# EAGLE schematic INITIAL_DESIGN (EAGLE 7.5.0)
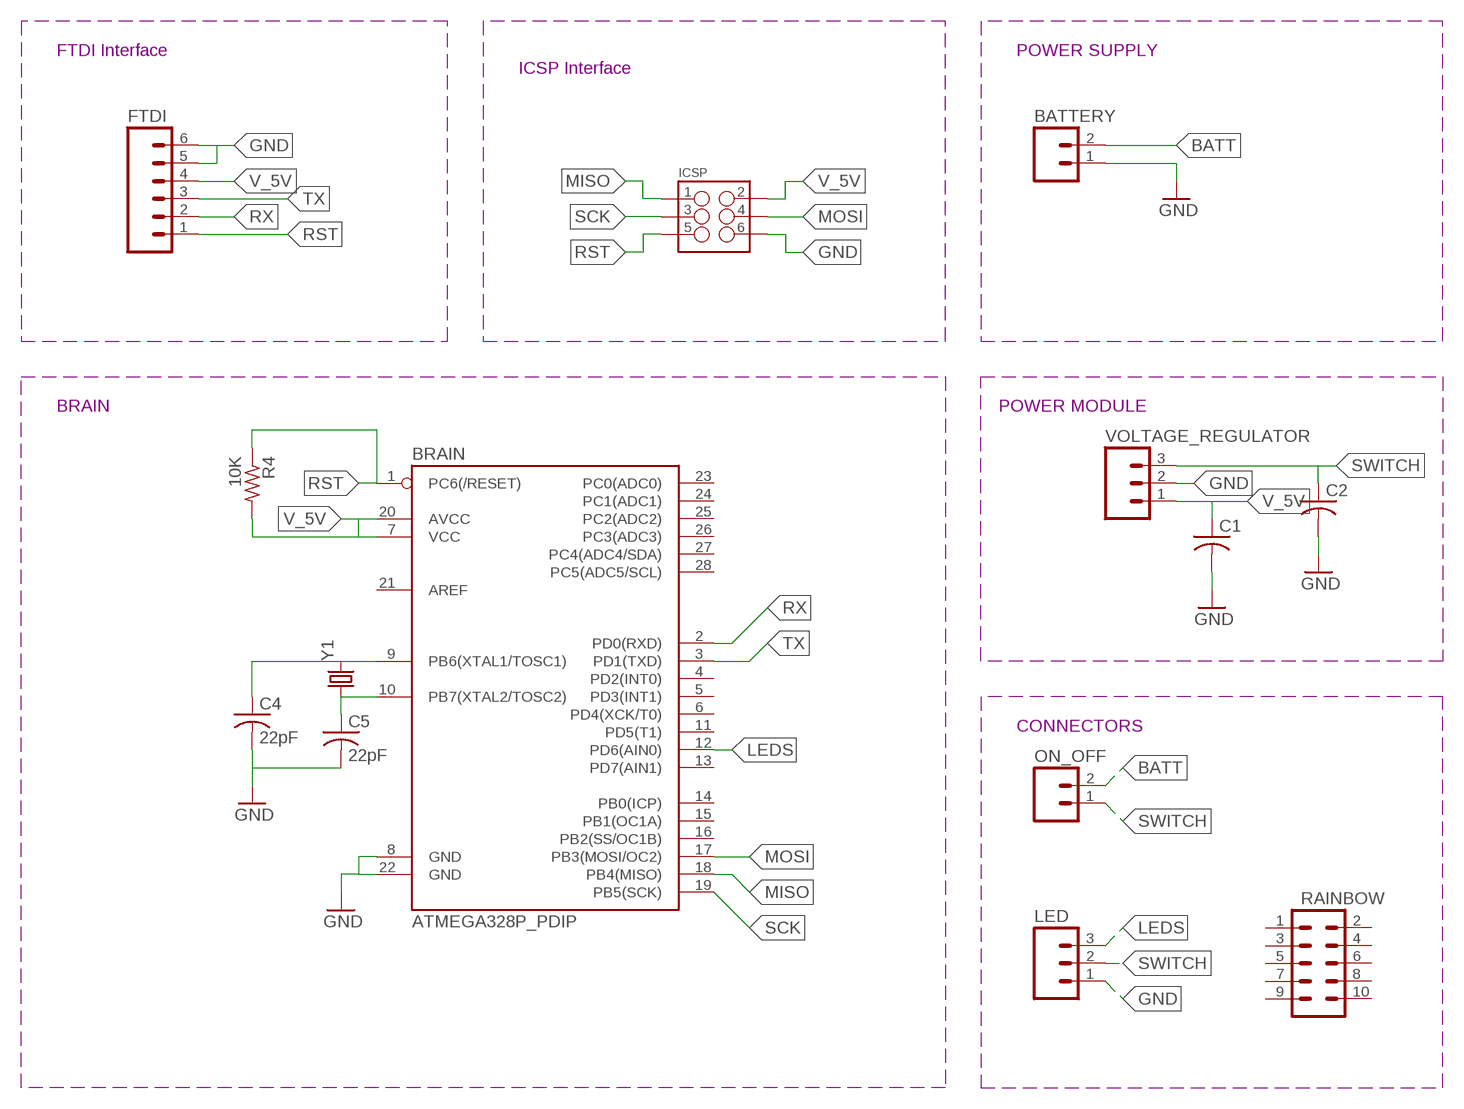
[diagram p0: schematic, sheet 1]

## Parts
BATTERY  M02PTH  [1X02]
BRAIN  ATMEGA328P_PDIP  [DIL28-3]
C1  C-US025-025X050  [C025-025X050]
C2  C-US025-025X050  [C025-025X050]
C4  22pF  C-US025-024X044  [C025-024X044]
C5  22pF  C-US025-024X044  [C025-024X044]
FTDI  M06POLAR  [MOLEX-1X6]
ICSP  M03X2SHROUD  [2X3-SHROUDED]
LED  M03JST-PTH  [JST-3-PTH]
ON_OFF  M02-JST-2-PTH-NO_SILK  [JST-2-PTH-NS]
R4  10K  R-US_R0805  [R0805]
RAINBOW  M05X2SHD  [2X5-SHROUDED]
VOLTAGE_REGULATOR  M03PTH  [1X03]
Y1  CRYSTALHC49US  [HC49US]

## Nets
BATT: BATTERY.2 ON_OFF.2
GND: BATTERY.1 BRAIN.8(GND) BRAIN.22(GND) C1.2 C2.2 C4.2 C5.2 FTDI.5 FTDI.6 ICSP.6 LED.1 VOLTAGE_REGULATOR.2
LEDS: BRAIN.12(PD6(AIN0)) LED.3
MISO: BRAIN.18(PB4(MISO)) ICSP.1
MOSI: BRAIN.17(PB3(MOSI/OC2)) ICSP.4
N$19: BRAIN.9(PB6(XTAL1/TOSC1)) C4.1 Y1.2
N$20: BRAIN.10(PB7(XTAL2/TOSC2)) C5.1 Y1.1
RST: BRAIN.1(PC6(/RESET)) FTDI.1 ICSP.5 R4.1
RX: BRAIN.2(PD0(RXD)) FTDI.2
SCK: BRAIN.19(PB5(SCK)) ICSP.3
SWITCH: C2.1 LED.2 ON_OFF.1 VOLTAGE_REGULATOR.3
TX: BRAIN.3(PD1(TXD)) FTDI.3
V_5V: BRAIN.7(VCC) BRAIN.20(AVCC) C1.1 FTDI.4 ICSP.2 R4.2 VOLTAGE_REGULATOR.1
Unconnected: BRAIN.4(PD2(INT0)) BRAIN.5(PD3(INT1)) BRAIN.6(PD4(XCK/T0)) BRAIN.11(PD5(T1)) BRAIN.13(PD7(AIN1)) BRAIN.14(PB0(ICP)) BRAIN.15(PB1(OC1A)) BRAIN.16(PB2(SS/OC1B)) BRAIN.21(AREF) BRAIN.23(PC0(ADC0)) BRAIN.24(PC1(ADC1)) BRAIN.25(PC2(ADC2)) BRAIN.26(PC3(ADC3)) BRAIN.27(PC4(ADC4/SDA)) BRAIN.28(PC5(ADC5/SCL)) RAINBOW.1 RAINBOW.2 RAINBOW.3 RAINBOW.4 RAINBOW.5 RAINBOW.6 RAINBOW.7 RAINBOW.8 RAINBOW.9 RAINBOW.10

## Notes on the sheet
- FTDI Interface | POWER SUPPLY
- ICSP Interface
- BRAIN | POWER MODULE
- CONNECTORS

## Library data of the parts
BATTERY ON_OFF = SparkFun-Connectors:M02: Standard 2-pin 0.1" header. Use with - straight break away headers ( PRT-00116) - right angle break away headers (PRT-00553) - swiss pins (PRT-00743) - machine pins (PRT-00117) - female headers (PRT-00115) Molex polarized connector foot print use with: PRT-08233 with associated crimp pins and housings. 2.54_SCREWTERM for use with PRT-10571. 3.5mm Screw Terminal footprints for PRT-08084 5mm Screw Terminal footprints for use with PRT-08432
BRAIN = SparkFun-DigitalIC:ATMEGA328P_PDIP: uC used in the Arduino 32kb flash, 1k EEPROM, 2k SRAM This is the through-hole version of this chip.
C1 C2 C4 C5 = adafruit:C-US: CAPACITOR, American symbol
FTDI = SparkFun-Connectors:M06: Header 6 Standard 6-pin 0.1" header. Use with straight break away headers (SKU : PRT-00116), right angle break away headers (PRT-00553), swiss pins (PRT-00743), machine pins (PRT-00117), and female headers (PRT-00115). Molex polarized connector foot print use with SKU : PRT-08094 with associated crimp pins and housings. NOTES ON THE VARIANTS LOCK and LOCK_LONGPADS... This footprint was designed to help hold the alignment of a through-hole component (i.e. 6-pin header) while soldering it into place. You may notice that each hole has been shifted either up or down by 0.005 of an inch from it's more standard position (which is a perfectly straight line). This slight alteration caused the pins (the squares in the middle) to touch the edges of the holes. Because they are alternating, it causes a "brace" to hold the component in place. 0.005 has proven to be the perfect amount of "off-center" position when using our standard breakaway headers. Although looks a little odd when you look at the bare footprint, once you have a header in there, the alteration is very hard to notice. Also,if you push a header all the way into place, it is covered up entirely on the bottom side. This idea of altering the position of holes to aid alignment will be further integrated into the Sparkfun Library for other footprints. It can help hold any component with 3 or more connection pins.
ICSP = SparkFun-Connectors:M03X2: 2x3 .1" header. Shrouded, with keying- CONN-10681 SMT- CONN-11415 Pogo pins- HW-11044; PROD_ID: CONN-10681
LED = SparkFun-Connectors:M03: Header 3 Standard 3-pin 0.1" header. Use with straight break away headers (SKU : PRT-00116), right angle break away headers (PRT-00553), swiss pins (PRT-00743), machine pins (PRT-00117), and female headers (PRT-00115). Molex polarized connector foot print use with SKU : PRT-08232 with associated crimp pins and housings.; SKU: PRT-09915
R4 = adafruit:R-US_: RESISTOR, American symbol
RAINBOW = SparkFun-Connectors:M05X2: Header 5x2 Standard 10-pin dual row 0.1" header. Commonly used with AVR-ISP. Use with Spark Fun Electronics SKU: PRT-00778
VOLTAGE_REGULATOR = SparkFun-Connectors:M03: Header 3 Standard 3-pin 0.1" header. Use with straight break away headers (SKU : PRT-00116), right angle break away headers (PRT-00553), swiss pins (PRT-00743), machine pins (PRT-00117), and female headers (PRT-00115). Molex polarized connector foot print use with SKU : PRT-08232 with associated crimp pins and housings.
Y1 = SparkFun-FreqCtrl:CRYSTAL: Various standard crystals. Proven footprints.

## Net classes
0 default: width 0.254 mm